# EasyEDA schematic motion-sensor-EasyEDA.json
TITLE: Sheet_1; REV: 1.0; Date: 2022-01-11; Sheet: 1/1; Company: Your Company
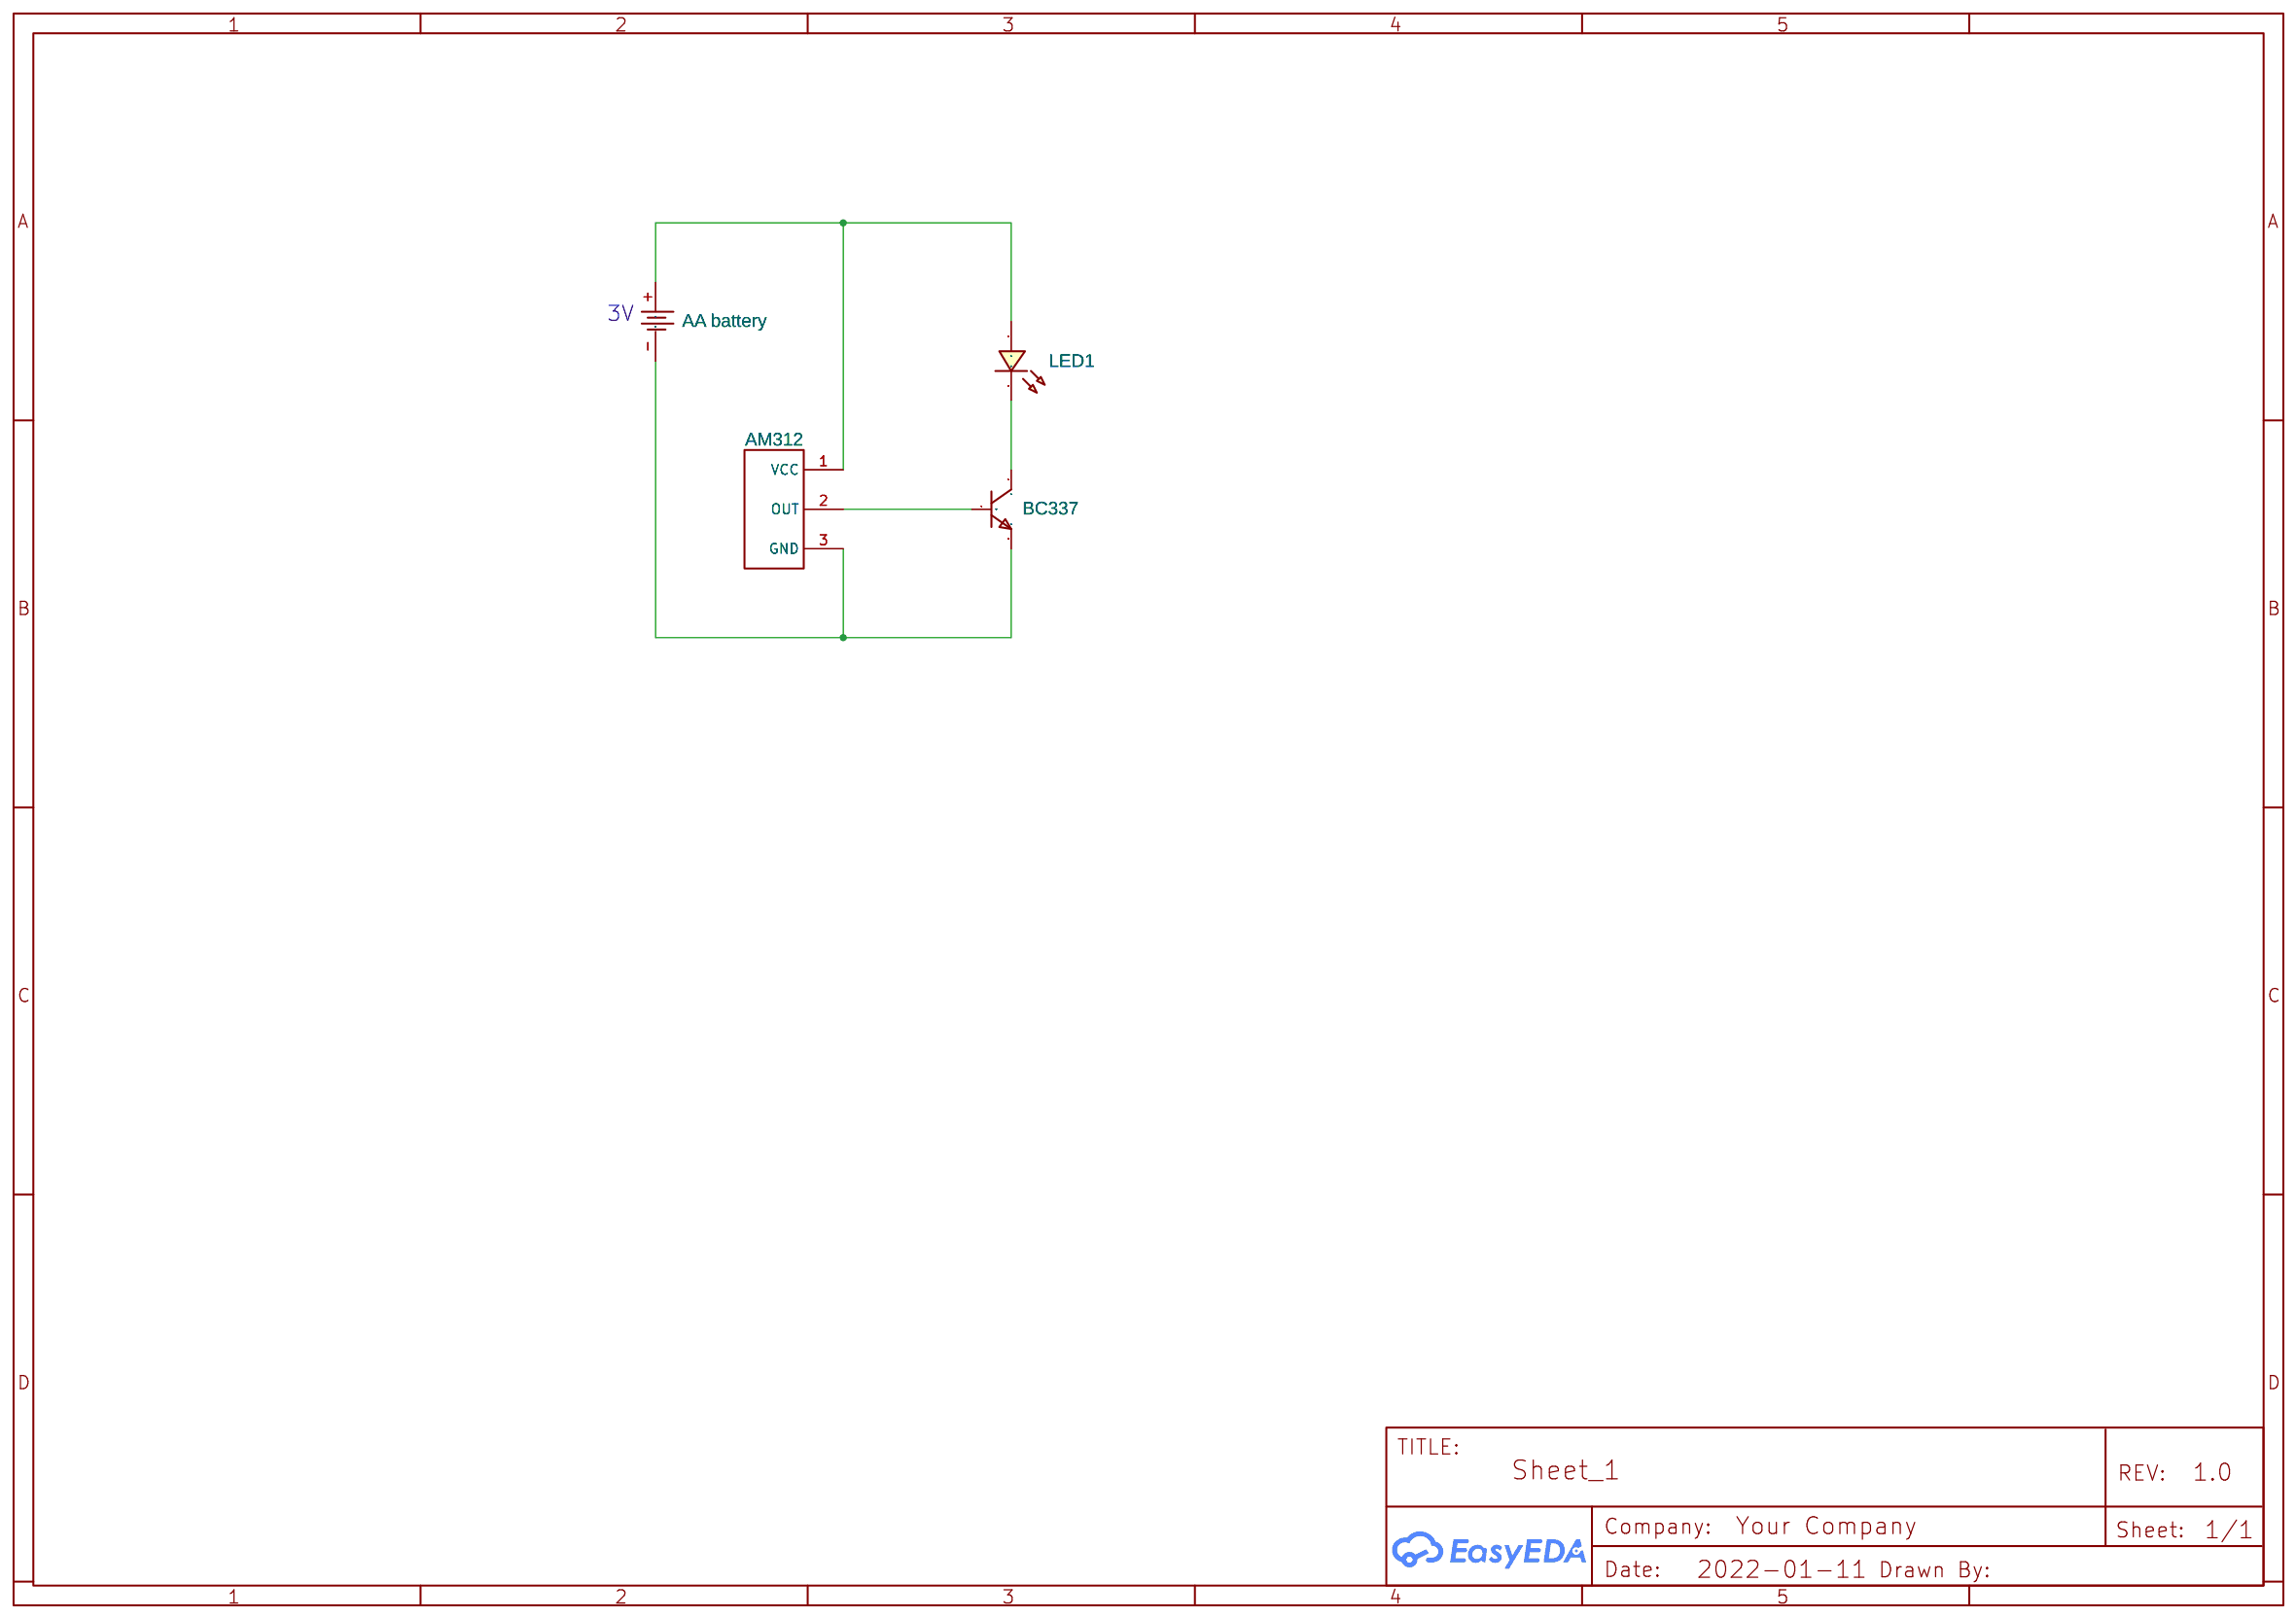
[diagram p0: schematic sheet]

## Parts
B1  AA battery  [BAT-SMD_CR1220-2]
LED1  .  [LED0603_RED]
Q1  BC337  [TO-92-3_L4.9-W3.7-P1.27-L]
U1  AM312  [TO-5-3_L8.2-W8.2]

## Library data of the parts
B1 = CR1220-2: Supplier: LCSC; Manufacturer: Q&J; image: //image.lceda.cn/szlcsc/C70381.jpg; Supplier Part: C70381
LED1 = LED-0603_R: Manufacturer: EVERLIGHT(台湾亿光); Manufacturer Part: 19-217/R6C-AL1M2VY/3T; Supplier Part: C72044; Supplier: LCSC; Contributor: LCEDA_01
Q1 = BC337: Supplier Part: C154963; Supplier: LCSC; Manufacturer: CJ(江苏长电/长晶); Contributor: LCSC; JLCPCB Part Class: Extended Part
U1 = AM312: Supplier: LCSC; Manufacturer: 森霸; Supplier Part: C114881; JLCPCB Part Class: Extended Part

## Nets
Net-(B1-+): B1.+(1) LED1.1 U1.1(VCC)
Net-(B1--): B1.-(2) Q1.3(E) U1.3(GND)
Net-(LED1-2): LED1.2 Q1.1(C)
Net-(Q1-2): Q1.2(B) U1.2(OUT)

## Notes on the sheet
- 3V
